# EAGLE schematic Gadget-Box (EAGLE 6.6.0)

## Sheet 1 of 3
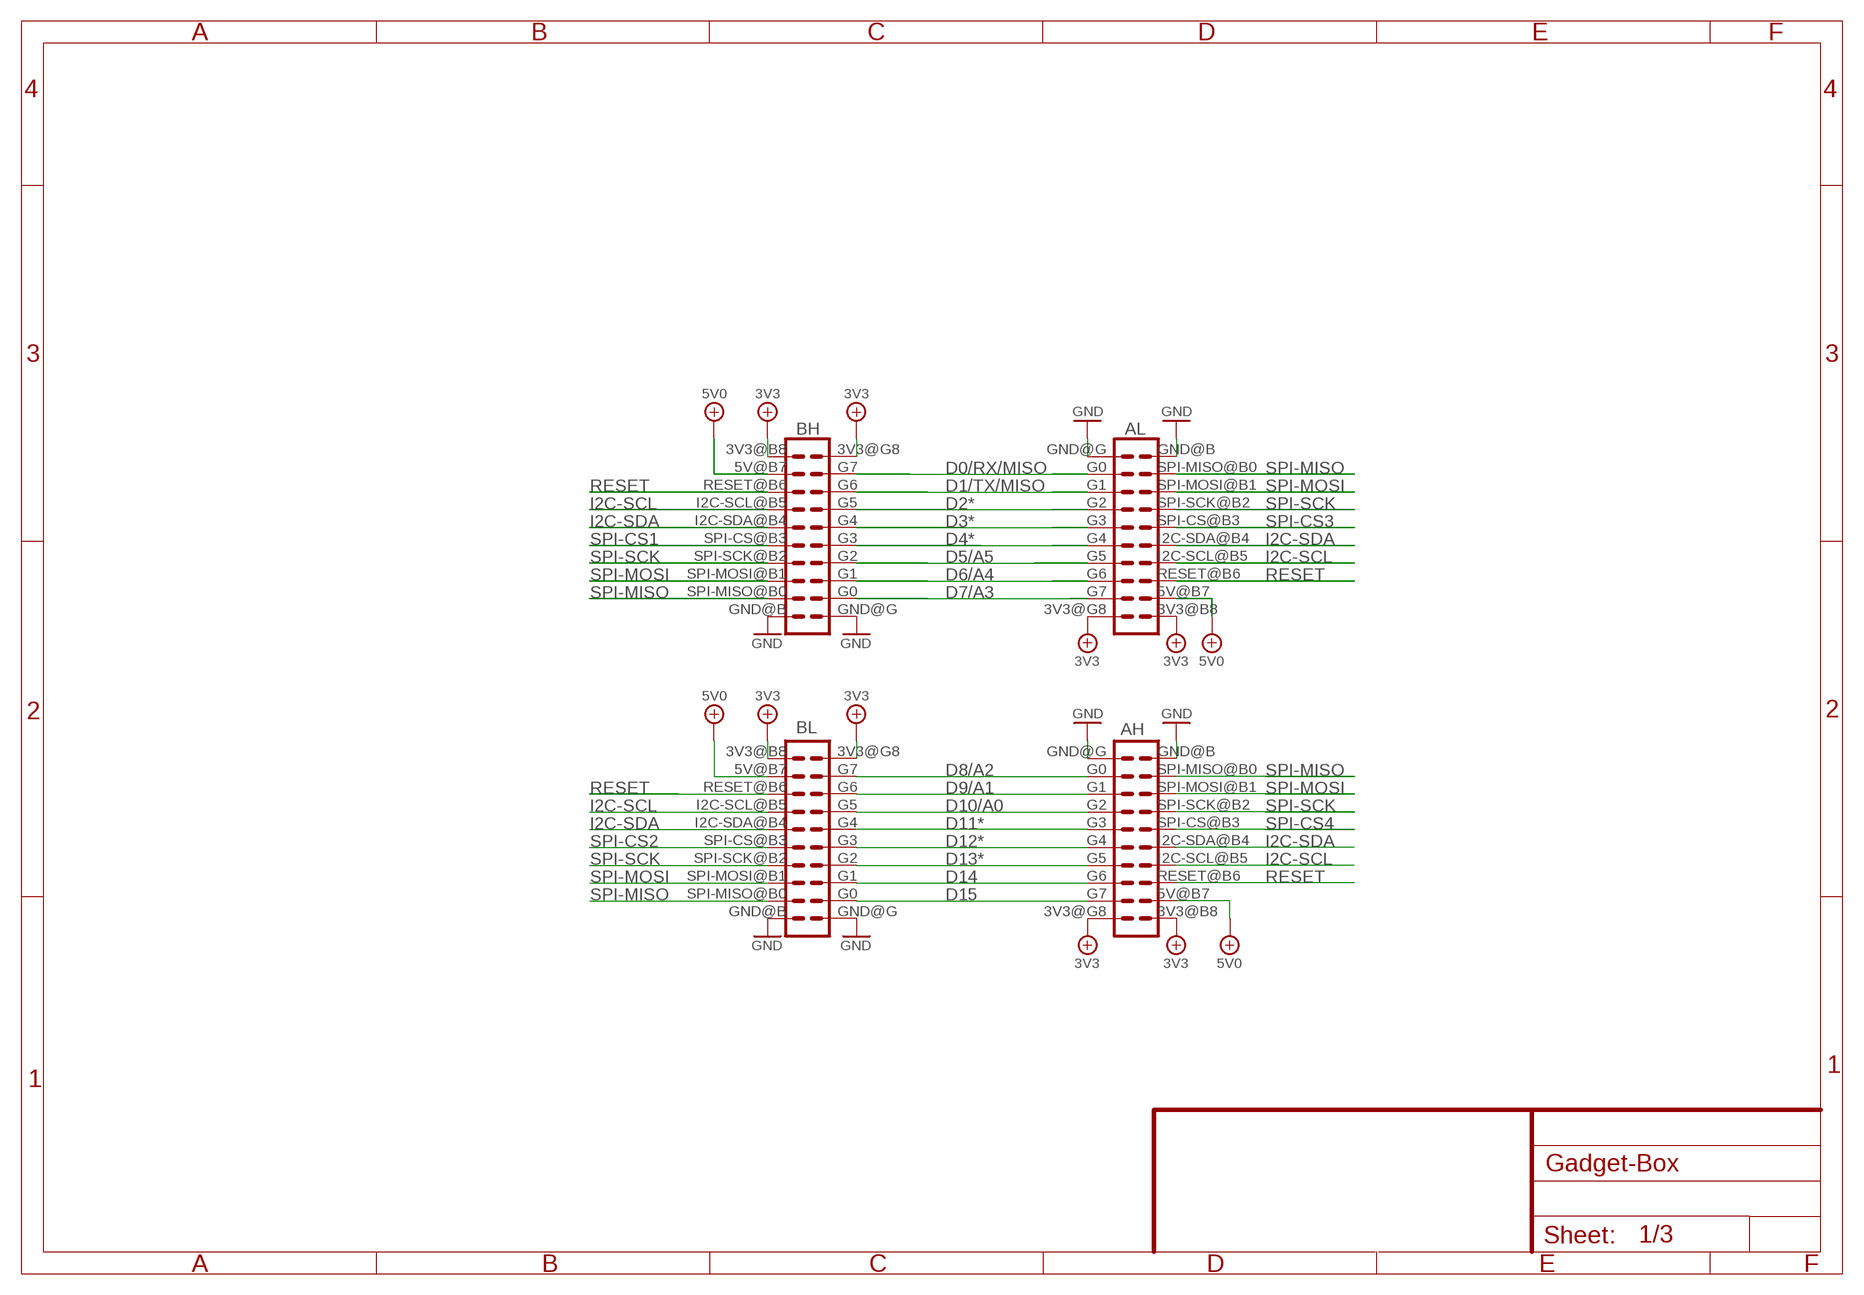
[diagram p0: schematic, sheet 1]

### Parts
AH  ECOGECOG_SLOT  [ECOG]
AL  ECOGECOG_SLOT  [ECOG]
BH  ECOGECOG_SLOT  [ECOG]
BL  ECOGECOG_SLOT  [ECOG]

### Nets
3V3: AH.3V3@B8(3V3) AH.3V3@G8(3V3) AL.3V3@B8(3V3) AL.3V3@G8(3V3) BH.3V3@B8(3V3) BH.3V3@G8(3V3) BL.3V3@B8(3V3) BL.3V3@G8(3V3) ; also sheet 2,3
D0/RX/MISO: AL.G0 BH.G7 ; also sheet 2
D1/TX/MISO: AL.G1 BH.G6 ; also sheet 2
D2*: AL.G2 BH.G5 ; also sheet 2
D3*: AL.G3 BH.G4 ; also sheet 2
D4*: AL.G4 BH.G3 ; also sheet 2
D5/A5: AL.G5 BH.G2 ; also sheet 2,3
D6/A4: AL.G6 BH.G1 ; also sheet 2
D7/A3: AL.G7 BH.G0 ; also sheet 2
D8/A2: AH.G0 BL.G7 ; also sheet 2
D9/A1: AH.G1 BL.G6 ; also sheet 2
D10/A0: AH.G2 BL.G5 ; also sheet 2
D11*: AH.G3 BL.G4 ; also sheet 2
D12*: AH.G4 BL.G3 ; also sheet 2
D13*: AH.G5 BL.G2 ; also sheet 2
D14: AH.G6 BL.G1 ; also sheet 2
D15: AH.G7 BL.G0 ; also sheet 2
GND [gnd]: AH.GND@B(GND) AH.GND@G(GND) AL.GND@B(GND) AL.GND@G(GND) BH.GND@B(GND) BH.GND@G(GND) BL.GND@B(GND) BL.GND@G(GND) ; also sheet 2,3
I2C-SCL: AH.I2C-SCL@B5(I2C-SCL) AL.I2C-SCL@B5(I2C-SCL) BH.I2C-SCL@B5(I2C-SCL) BL.I2C-SCL@B5(I2C-SCL) ; also sheet 2
I2C-SDA: AH.I2C-SDA@B4(I2C-SDA) AL.I2C-SDA@B4(I2C-SDA) BH.I2C-SDA@B4(I2C-SDA) BL.I2C-SDA@B4(I2C-SDA) ; also sheet 2
RESET: AH.RESET@B6(RESET) AL.RESET@B6(RESET) BH.RESET@B6(RESET) BL.RESET@B6(RESET) ; also sheet 2
SPI-CS1: BH.SPI-CS@B3(SPI-CS) ; also sheet 2
SPI-CS2: BL.SPI-CS@B3(SPI-CS) ; also sheet 2
SPI-CS3: AL.SPI-CS@B3(SPI-CS) ; also sheet 2
SPI-CS4: AH.SPI-CS@B3(SPI-CS) ; also sheet 2
SPI-MISO: AH.SPI-MISO@B0(SPI-MISO) AL.SPI-MISO@B0(SPI-MISO) BH.SPI-MISO@B0(SPI-MISO) BL.SPI-MISO@B0(SPI-MISO) ; also sheet 2
SPI-MOSI: AH.SPI-MOSI@B1(SPI-MOSI) AL.SPI-MOSI@B1(SPI-MOSI) BH.SPI-MOSI@B1(SPI-MOSI) BL.SPI-MOSI@B1(SPI-MOSI) ; also sheet 2
SPI-SCK: AH.SPI-SCK@B2(SPI-SCK) AL.SPI-SCK@B2(SPI-SCK) BH.SPI-SCK@B2(SPI-SCK) BL.SPI-SCK@B2(SPI-SCK) ; also sheet 2
VBUS: AH.5V@B7(5V) AL.5V@B7(5V) BH.5V@B7(5V) BL.5V@B7(5V) ; supply symbol labelled 5V0 ; also sheet 2,3

## Sheet 2 of 3
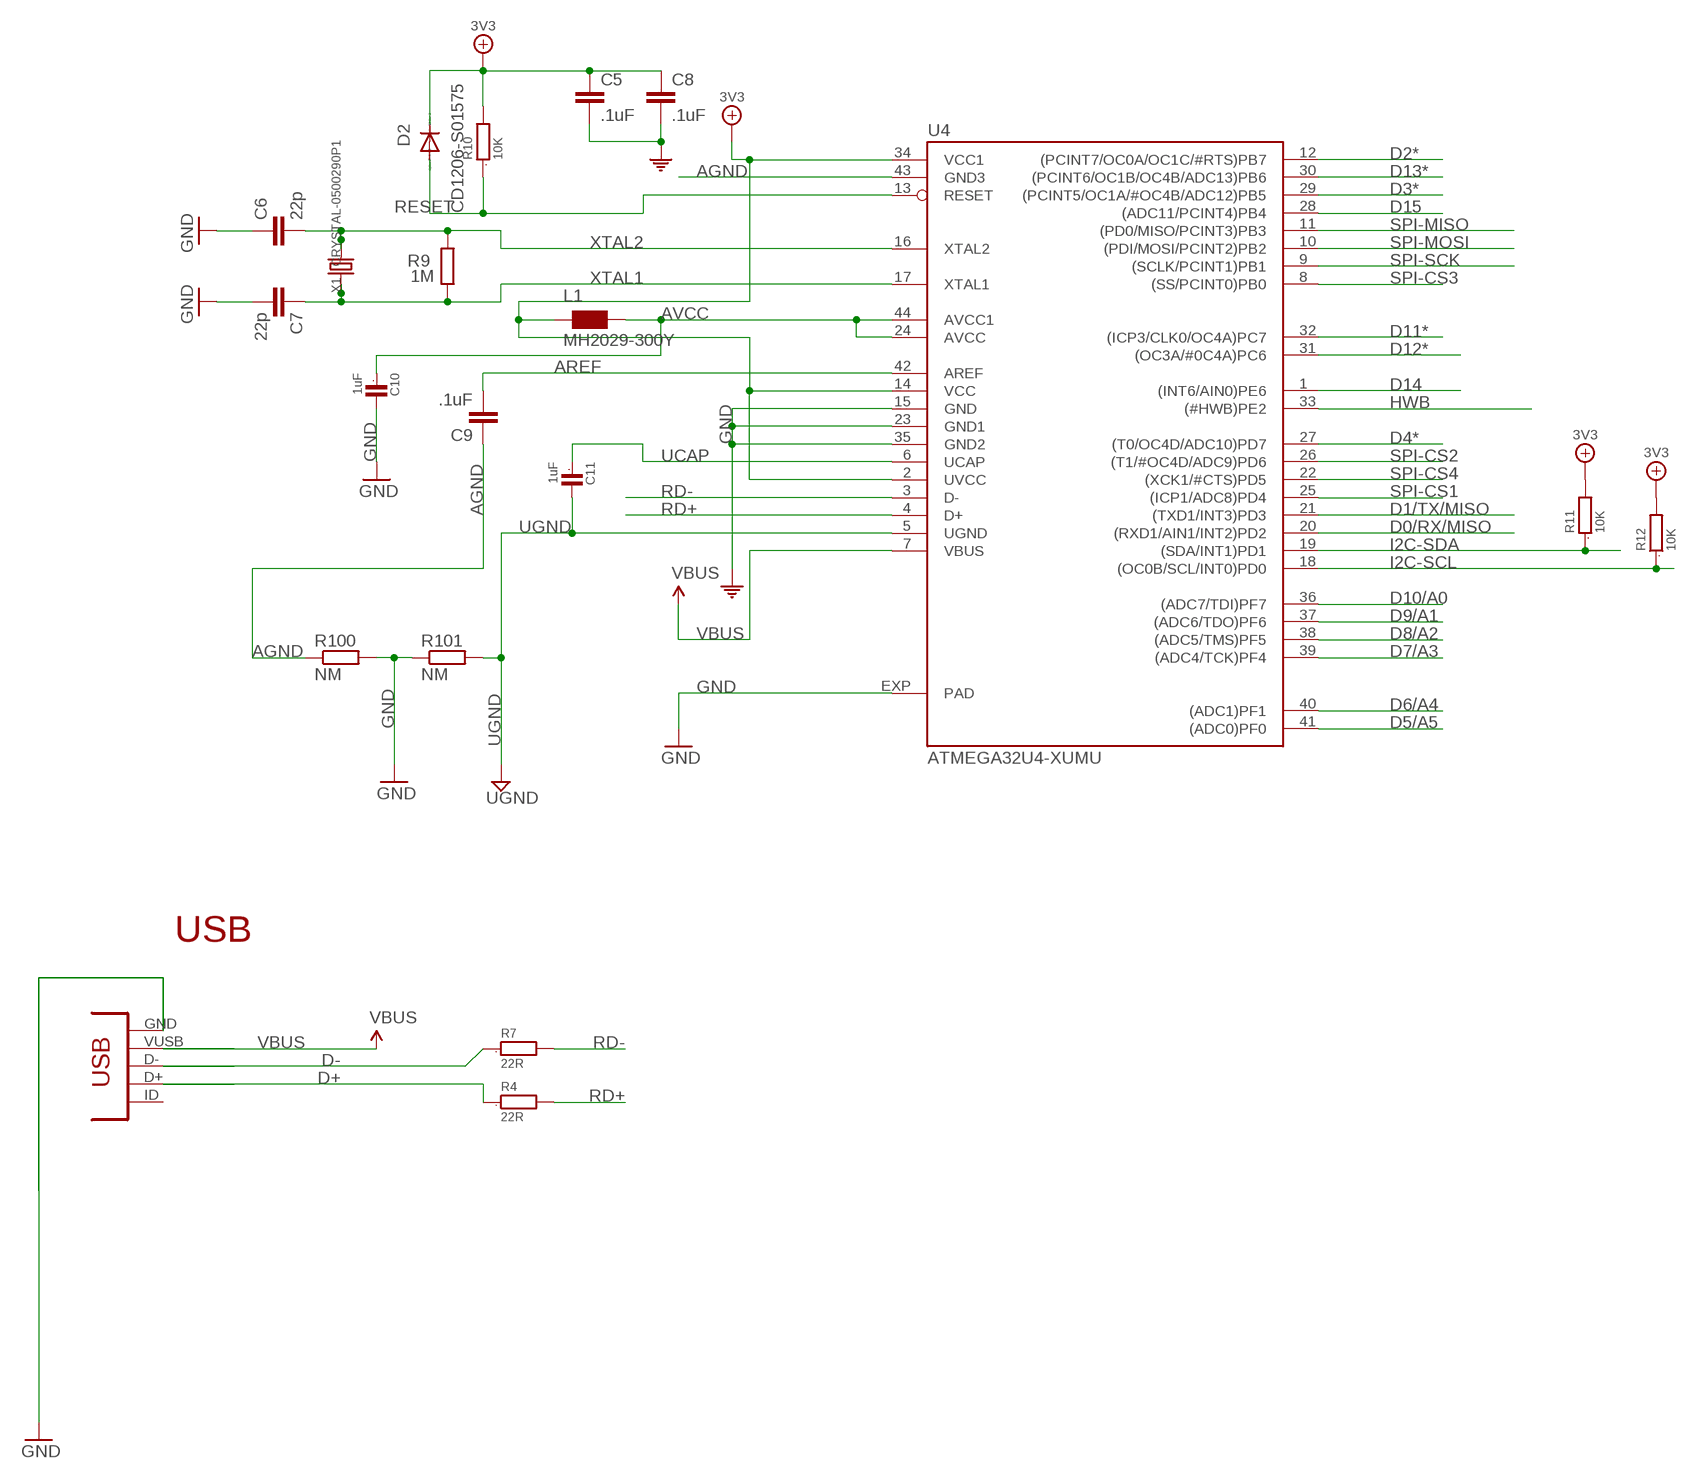
[diagram p1: schematic, sheet 2, part 1 of 2]
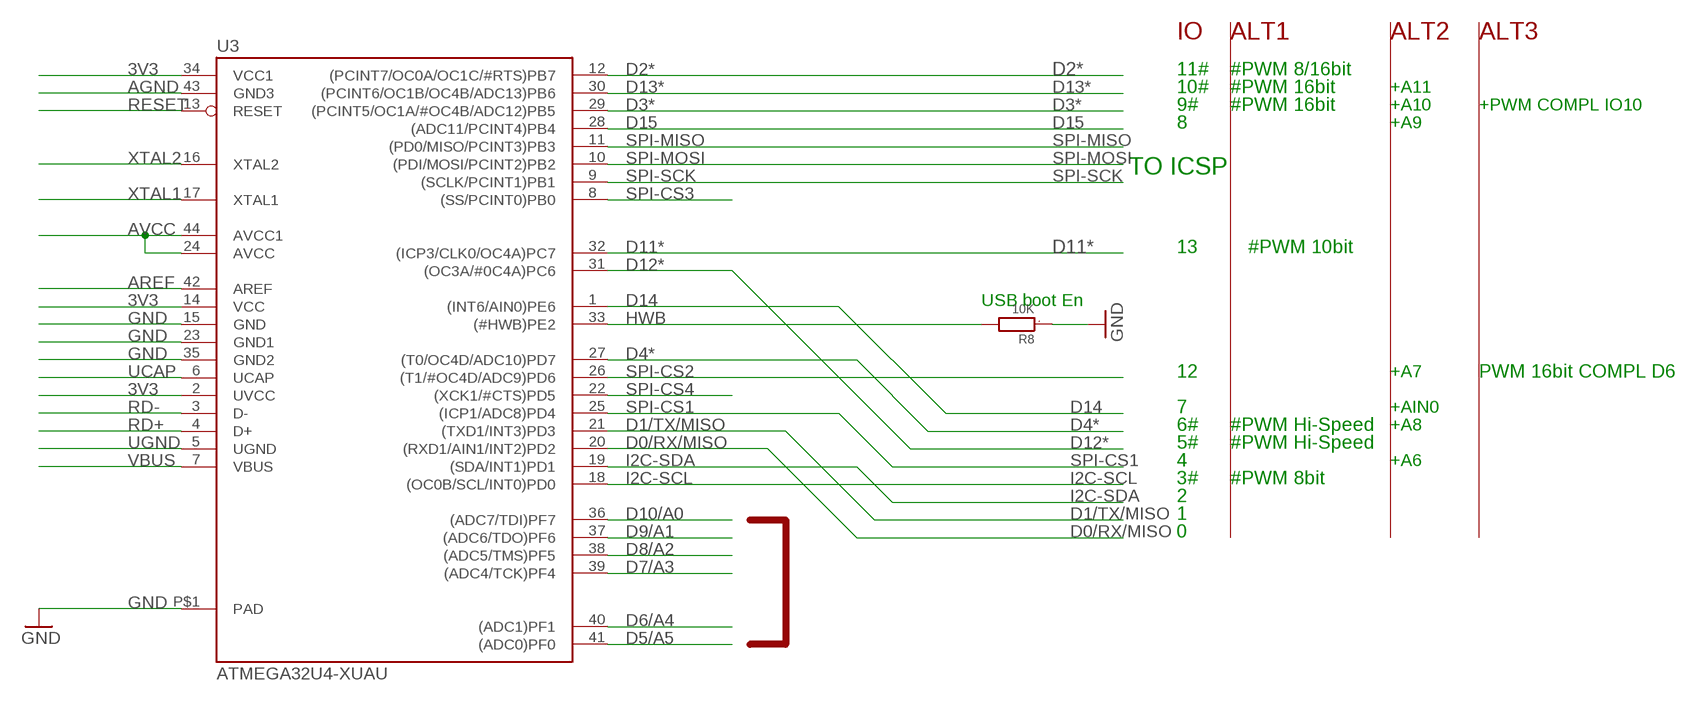
[diagram p2: schematic, sheet 2, part 2 of 2]

### Parts
C5  .1uF  C-EUC0603  [C0603-ROUND]
C6  22p  C-EUC0603  [C0603-ROUND]
C7  22p  C-EUC0603  [C0603-ROUND]
C8  .1uF  C-EUC0603  [C0603-ROUND]
C9  .1uF  C-EUC0603  [C0603-ROUND]
C10  1uF  C0603  [0603]
C11  1uF  C0603  [0603]
D2  CD1206-S01575  DIODE-MINIMELF  [MINIMELF]
L1  MH2029-300Y  WE-CBF_0805  [0805]
R4  22R  R0805  [0805]
R7  22R  R0805  [0805]
R8  10K  R0603  [0603]
R9  1M  R-EU_R0603  [R0603-ROUND]
R10  10K  R0603  [0603]
R11  10K  R0603  [0603]
R12  10K  R0603  [0603]
R100  NM  R-EU_R0402  [R0402]
R101  NM  R-EU_R0402  [R0402]
U3  ATMEGA32U4-XUAU  [TQFP44-PAD]
U4  ATMEGA32U4-XUMU  [QFN44ML7X7]
USB  CONN_USB  [CONN_USB_MINI-B]
X1  CRYSTAL-0500290P1  [2P-SMD-5.0X3.2]

### Nets
3V3: C5.1 C8.1 D2.C L1.1 R10.2 R11.2 R12.2 U3.2(UVCC) U3.14(VCC) U3.34(VCC1) U4.2(UVCC) U4.14(VCC) U4.34(VCC1) ; also sheet 1,3
AGND: C9.1 R100.1 U3.43(GND3) U4.43(GND3)
AREF [aref]: C9.2 U3.42(AREF) U4.42(AREF)
AVCC: C10.1 L1.2 U3.24(AVCC) U3.44(AVCC1) U4.24(AVCC) U4.44(AVCC1)
D0/RX/MISO: U3.20((RXD1/AIN1/INT2)PD2) U4.20((RXD1/AIN1/INT2)PD2) ; also sheet 1
D1/TX/MISO: U3.21((TXD1/INT3)PD3) U4.21((TXD1/INT3)PD3) ; also sheet 1
D2*: U3.12((PCINT7/OC0A/OC1C/#RTS)PB7) U4.12((PCINT7/OC0A/OC1C/#RTS)PB7) ; also sheet 1
D3*: U3.29((PCINT5/OC1A/#OC4B/ADC12)PB5) U4.29((PCINT5/OC1A/#OC4B/ADC12)PB5) ; also sheet 1
D4*: U3.27((T0/OC4D/ADC10)PD7) U4.27((T0/OC4D/ADC10)PD7) ; also sheet 1
D5/A5: U3.41((ADC0)PF0) U4.41((ADC0)PF0) ; also sheet 1,3
D6/A4: U3.40((ADC1)PF1) U4.40((ADC1)PF1) ; also sheet 1
D7/A3: U3.39((ADC4/TCK)PF4) U4.39((ADC4/TCK)PF4) ; also sheet 1
D8/A2: U3.38((ADC5/TMS)PF5) U4.38((ADC5/TMS)PF5) ; also sheet 1
D9/A1: U3.37((ADC6/TDO)PF6) U4.37((ADC6/TDO)PF6) ; also sheet 1
D10/A0: U3.36((ADC7/TDI)PF7) U4.36((ADC7/TDI)PF7) ; also sheet 1
D11*: U3.32((ICP3/CLK0/OC4A)PC7) U4.32((ICP3/CLK0/OC4A)PC7) ; also sheet 1
D12*: U3.31((OC3A/#0C4A)PC6) U4.31((OC3A/#0C4A)PC6) ; also sheet 1
D13*: U3.30((PCINT6/OC1B/OC4B/ADC13)PB6) U4.30((PCINT6/OC1B/OC4B/ADC13)PB6) ; also sheet 1
D14: U3.1((INT6/AIN0)PE6) U4.1((INT6/AIN0)PE6) ; also sheet 1
D15: U3.28((ADC11/PCINT4)PB4) U4.28((ADC11/PCINT4)PB4) ; also sheet 1
D+: R4.1 USB.D+
D-: R7.1 USB.D-
GND [gnd]: C5.2 C6.1 C7.2 C8.2 C10.2 R8.1 R100.2 R101.1 U3.15(GND) U3.23(GND1) U3.35(GND2) U3.P$1(PAD) U4.15(GND) U4.23(GND1) U4.35(GND2) U4.EXP(PAD) USB.GND ; supply symbol labelled COM ; also sheet 1,3
HWB: R8.2 U3.33((#HWB)PE2) U4.33((#HWB)PE2)
I2C-SCL: R12.1 U3.18((OC0B/SCL/INT0)PD0) U4.18((OC0B/SCL/INT0)PD0) ; also sheet 1
I2C-SDA: R11.1 U3.19((SDA/INT1)PD1) U4.19((SDA/INT1)PD1) ; also sheet 1
RD+: R4.2 U3.4(D+) U4.4(D+)
RD-: R7.2 U3.3(D-) U4.3(D-)
RESET: D2.A R10.1 U3.13(RESET) U4.13(RESET) ; also sheet 1
SPI-CS1: U3.25((ICP1/ADC8)PD4) U4.25((ICP1/ADC8)PD4) ; also sheet 1
SPI-CS2: U3.26((T1/#OC4D/ADC9)PD6) U4.26((T1/#OC4D/ADC9)PD6) ; also sheet 1
SPI-CS3: U3.8((SS/PCINT0)PB0) U4.8((SS/PCINT0)PB0) ; also sheet 1
SPI-CS4: U3.22((XCK1/#CTS)PD5) U4.22((XCK1/#CTS)PD5) ; also sheet 1
SPI-MISO: U3.11((PD0/MISO/PCINT3)PB3) U4.11((PD0/MISO/PCINT3)PB3) ; also sheet 1
SPI-MOSI: U3.10((PDI/MOSI/PCINT2)PB2) U4.10((PDI/MOSI/PCINT2)PB2) ; also sheet 1
SPI-SCK: U3.9((SCLK/PCINT1)PB1) U4.9((SCLK/PCINT1)PB1) ; also sheet 1
UCAP: C11.1 U3.6(UCAP) U4.6(UCAP)
UGND [gnd]: C11.2 R101.2 U3.5(UGND) U4.5(UGND)
VBUS: U3.7(VBUS) U4.7(VBUS) USB.VUSB ; also sheet 1,3
XTAL1: C7.1 R9.1 U3.17(XTAL1) U4.17(XTAL1) X1.1
XTAL2: C6.2 R9.2 U3.16(XTAL2) U4.16(XTAL2) X1.2
Unconnected: USB.BODY@1(BODY) USB.BODY@2(BODY) USB.BODY@3(BODY) USB.BODY@4(BODY) USB.ID(USBID)

### Notes on the sheet
- IO | ALT1 | ALT2 | ALT3
- 11# | #PWM 8/16bit
- 10# | #PWM 16bit | +A11
- 9# | #PWM 16bit | +A10 | +PWM COMPL IO10
- 8 | +A9
- TO ICSP
- 13 | #PWM 10bit
- USB boot En
- 12 | +A7 | PWM 16bit COMPL D6
- 7 | +AIN0
- 6# | #PWM Hi-Speed | +A8
- 5# | #PWM Hi-Speed
- 4 | +A6
- 3# | #PWM 8bit
- 2
- 1
- 0
- USB

## Sheet 3 of 3
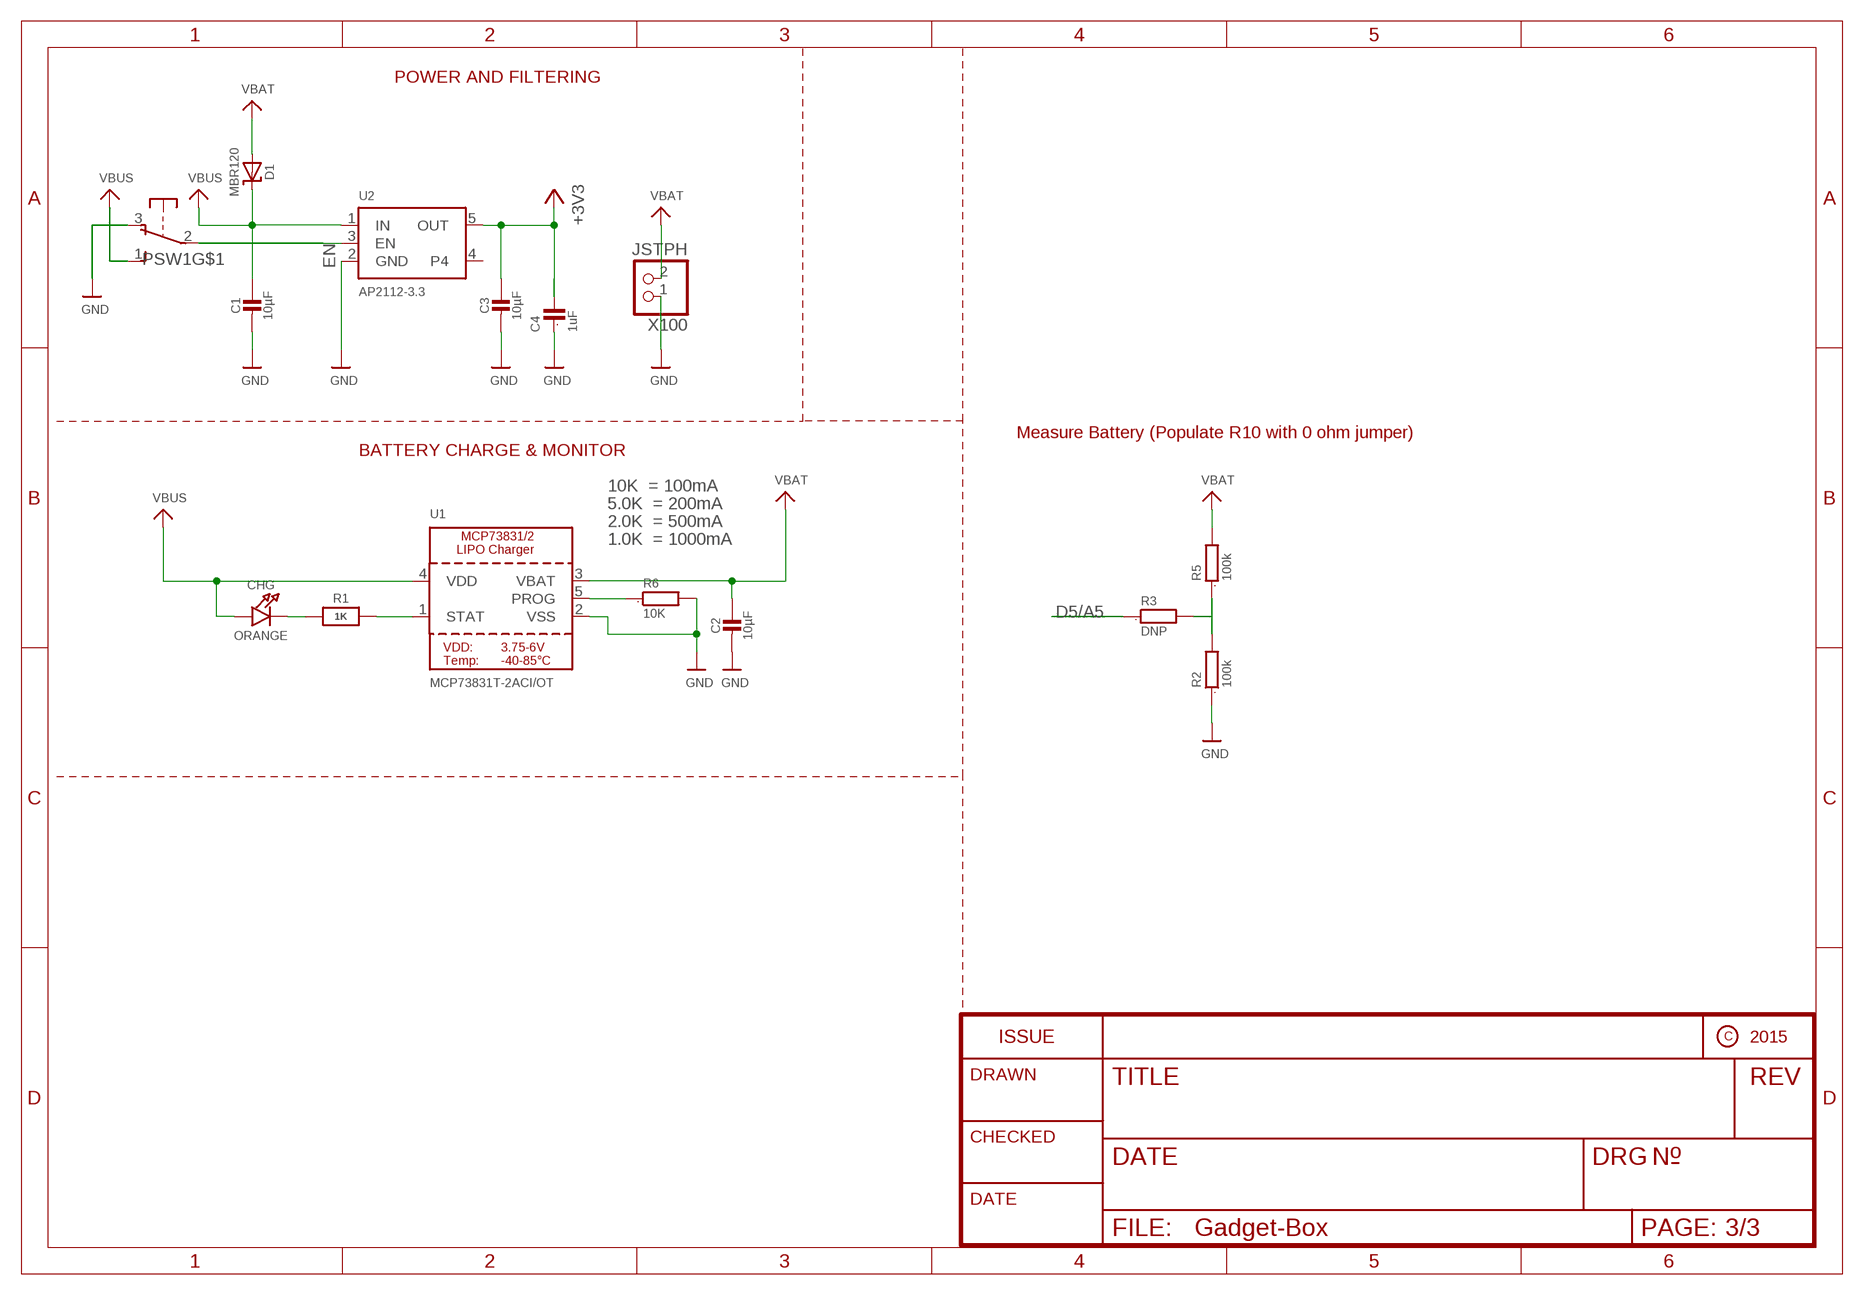
[diagram p3: schematic, sheet 3]

### Parts
C1  10µF  CAP_CERAMIC0805-NOOUTLINE  [0805-NO]
C2  10µF  CAP_CERAMIC0805-NOOUTLINE  [0805-NO]
C3  10µF  CAP_CERAMIC0805-NOOUTLINE  [0805-NO]
C4  1uF  C0603  [0603]
CHG  ORANGE  LED0805_NOOUTLINE  [CHIPLED_0805_NOOUTLINE]
D1  MBR120  DIODE-SCHOTTKYSOD-123  [SOD-123]
PSW1  OS102011MA1Q  [OS102011MA1Q]
R1  1K  RESISTOR_0603_NOOUT  [0603-NO]
R2  100k  R0603  [0603]
R3  DNP  R0603  [0603]
R5  100k  R0603  [0603]
R6  10K  R0603  [0603]
U1  MCP73831T-2ACI/OT  MCP73831/2  [SOT23-5]
U2  AP2112-3.3  VREG_SOT23-5  [SOT23-5]
X100  JSTPH  CON_JST_PH_2PIN  [JSTPH2]

### Nets
3V3: C3.1 C4.2 U2.5(OUT) ; supply symbol labelled +3V3 ; also sheet 1,2
D5/A5: R3.1 ; also sheet 1,2
EN: PSW1.2(P) U2.3(EN)
GND [gnd]: C1.2 C2.2 C3.2 C4.1 PSW1.3(O) R2.1 R6.2 U1.2(VSS) U2.2(GND) X100.1 ; also sheet 1,2
N$1: CHG.C R1.1
N$2: R2.2 R3.2 R5.1
N$3: R1.2 U1.1(STAT)
N$4: R6.1 U1.5(PROG)
VBAT: C2.1 D1.A R5.2 U1.3(VBAT) X100.2
VBUS: C1.1 CHG.A D1.C PSW1.1(S) U1.4(VDD) U2.1(IN) ; also sheet 1,2
Unconnected: PSW1.MT1(MT) PSW1.MT2(MT) U2.4

### Notes on the sheet
- POWER AND FILTERING
- Measure Battery (Populate R10 with 0 ohm jumper)
- BATTERY CHARGE & MONITOR
- 10K  = 100mA
- 5.0K  = 200mA
- 2.0K  = 500mA
- 1.0K  = 1000mA

## Library data of the parts
AH AL BH BL = eCogs:ECOG; PARTNO: PPPC102LFBN-RC,SULLINS CONNECTOR SOLUTIONS,dk,S6106-ND,"CONN HEADER FEM 20POS.1"" DL GOLD", REF67
C1-C3 = microbuilder:CAP_CERAMIC: Ceramic Capacitors For new designs, use the packages preceded by an '_' character since they are more reliable: The following footprints should be used on most boards: _0402 - Standard footprint for regular board layouts _0603 - Standard footprint for regular board layouts _0805 - Standard footprint for regular board layouts _1206 - Standard footprint for regular board layouts For extremely tight-pitch boards where space is at a premium, the following 'micro-pitch' footprints can be used (smaller pads, no silkscreen outline, etc.): _0402MP - Micro-pitch footprint for very dense/compact boards _0603MP - Micro-pitch footprint for very dense/compact boards _0805MP - Micro-pitch footprint for very dense/compact boards _1206MP - Micro-pitch footprint for very dense/compact boards; PARTNO: CL21F106ZPFNNNE,Samsung,DK,1276-3012-1-ND,CAP CER 10UF 10V Y5V 0805, REF1
C4 C10 C11 = GadgetFactory:C: CAPACITOR, European symbol; PARTNO: C1608X5R1A105K080AC,TDK CORPORATION (VA),dk,445-1321-1-ND,CAP CER 1UF 10V X5R 0603, REF53
C5 C8 C9 = SmartPrj:C-EU: CAPACITOR, European symbol; PARTNO: GRM188F51E104ZA01D,MURATA ELECTRONICS (VA),DK,490-1575-1-ND,CAP CER .1UF 25V Y5V 0603, REF2
C6 C7 = SmartPrj:C-EU: CAPACITOR, European symbol; PARTNO: C1608C0G1H220J080AA,TDK CORPORATION (VA),dk,445-1273-1-ND,CAP CER 22PF 50V C0G 0603, REF58
CHG = microbuilder:LED: LED 0603 - 0603 Surface Mount Package 2mA: Green LED - Low Power (3.9mcd, 2ma, 1.7Vf) - Digikey: 475-2709-2-ND Orange LED - Low Power (9.8mcd, 2ma, 1.8Vf) - Digikey: 475-1194-2-ND Red LED - Low Power (5mcd, 2ma, 1.8Vf) - Digikey: 475-1195-2-ND Yellow LED - Low Power (7mcd, 2ma, 1.8Vf) - Digikey: 475-1196-2-ND 5mA: Blue LED - Low Power (17mcd, 5ma, 2.9Vf) - Digikey: LNJ937W8CRACT-ND 0805 - 0805 Surface Mount Package 2mA: Red LED (8.8mcd, 2mA, 1.8Vf, Clear) - Low Power [Digikey: 475-2510-1-ND] Green LED (5mcd, 2mA, 1.8Vf, Clear) - Low Power [Digikey: 475-2730-1-ND] Yellow LED (11.3mcd, 2mA, 1.8Vf, Clear) - Low Power [Digikey: 475-2555-1-ND] 20mA: Red LED (104mcd, 20mA, Diffused) - LS R976 [Digikey: 475-1278-6-ND] Red LED (12mcd, 20mA, 2.0Vf, Clear) - APT2012EC [Digikey: 754-1128-1-ND] Green LED (15mcd, 20mA, 2.2Vf, Clear) - APT2012GC [Digikey: 754-1131-1-ND] Orange LED (160mcd, 20mA, 2.1Vf, Clear) - APT2012SECK [Digikey: 754-1130-1-ND] 1206 - 1206 Surface Mount Package Green LED (26mcd, 20mA, Diffused) - LG N971 [Digikey: 475-1407-6-ND] Red LED (15mcd, 20mA, Diffused) - LH N974 [Digikey: 475-1416-6-ND] Cree - Cree High-Power Surface Mount LEDs XPEBWT-L1-0000-00D50 - White 111lm 350mA 2.9Vf 6200K 110° XTEAWT-00-0000-00000LEE3 - White 114lm 350mA 2.85Vf 5000K 115° Everlight - Everlight 45-21 Series Surface Mount LEDs 45-21/QK2C-B2832AC2CB2/2T - Warm White 2000mcd 20mA 3.25Vf 3050K 120° 45-21/LK2C-B38452C4CB2/2T - Nuetral White 2000mcd 20mA 3.25Vf 4150K 120° 45-21/LK2C-B50634C6CB2/2T - Cold White 2200mcd 20mA 3.25Vf 5650K 120° PLCC2 Reverse Mount LS T77K-J1L2-1-0-2-R18-Z - Red 11.25mcd 2mA 1.8Vf 630nm 120° LO T77K-L1M2-24-Z - Orange 19.6mcd 2mA 1.8Vf 606nm 120° LY T77K-K2M1-26-Z - Yellow 15.7mcd 2mA 1.8Vf 587nm 120°; PARTNO: LTST-C171EKT,LITE-ON INC (VA),DK,160-1422-1-ND,LED RED ORAN CLEAR THIN 0805 SMD, REF6
D1 = microbuilder:DIODE-SCHOTTKY; PARTNO: MBR120VLSFT3G,on semiconductor,dk,MBR120VLSFT3GOSCT-ND ,DIODE SCHOTTKY 20V 1A SOD123FL , REF71
D2 = diode:DIODE-: DIODE; PARTNO: CD1206-S01575,BOURNS INC (VA),dk,CD1206-S01575CT-ND,DIODE GEN PURP 100V 150MA 1206, REF46
L1 = wuerth-elektronik:WE-CBF: SMD EMI Suppression Ferrite Beads - excellent anti-EMI properties - low DCR - impedances till 3000 ohms - rated current up to 6 A; PARTNO: MH2029-300Y,BOURNS INC (VA),dk,MH2029-300YCT-ND,FERRITE BEAD 30 OHM 0805 1LN, REF60
PSW1 = adafruit:OS102011MA1Q: OS10201MA1Q through-hole right angle switch http://www.ladyada.net/library/eagle; PARTNO: OS102011MA1QN1,C&K Components,dk,CKN9559-ND,SWITCH SLIDE SPDT 100MA 12V , REF72
R1 = microbuilder:RESISTOR: Resistors For new designs, use the packages preceded by an '_' character since they are more reliable: The following footprints should be used on most boards: _0402 - Standard footprint for regular board layouts _0603 - Standard footprint for regular board layouts _0805 - Standard footprint for regular board layouts _1206 - Standard footprint for regular board layouts For extremely tight-pitch boards where space is at a premium, the following 'micro-pitch' footprints can be used (smaller pads, no silkscreen outline, etc.): _0402MP - Micro-pitch footprint for very dense/compact boards _0603MP - Micro-pitch footprint for very dense/compact boards _0805MP - Micro-pitch footprint for very dense/compact boards _1206MP - Micro-pitch footprint for very dense/compact boards; PARTNO: RC0603JR-071KL,YAGEO (VA),dk,311-1.0KGRTR-ND,RES SMD 1K OHM 5% 1/10W 0603 , REF73
R2 R5 = GadgetFactory:R: RESISTOR, European symbol; PARTNO: RC0603JR-07100KL,YAGEO (VA),dk,311-100KGRCT-ND,RES SMD 100K OHM 5% 1/10W 0603 , REF76
R3 = GadgetFactory:R: RESISTOR, European symbol; BOM: EXCLUDE
R4 R7 = GadgetFactory_6.0:R: RESISTOR, European symbol; PARTNO: RMCF0805JT22R0,STACKPOLE ELECTRONICS INC (VA),dk,RMCF0805JT22R0CT-ND,RES SMD 22 OHM 5% 1/8W 0805, REF62
R6 R11 R12 = GadgetFactory:R: RESISTOR, European symbol; PARTNO: RC0603JR-0710KL,YAGEO (VA),dk,311-10KGRCT-ND,RES SMD 10K OHM 5% 1/10W 0603 , REF36
R8 R10 = GadgetFactory_6.0:R: RESISTOR, European symbol; PARTNO: RC0603JR-0710KL,YAGEO (VA),dk,311-10KGRCT-ND,RES SMD 10K OHM 5% 1/10W 0603 , REF36
R9 = SmartPrj:R-EU_: RESISTOR, European symbol; PARTNO: RMCF0603JT1M00,STACKPOLE ELECTRONICS INC (VA),dk,RMCF0603JT1M00CT-ND,RES SMD 1M OHM 5% 1/10W 0603, REF57
R100 R101 = SmartPrj:R-EU_: RESISTOR, European symbol; BOM: EXCLUDE
U1 = microbuilder:MCP73831/2: MCP73831/2 LIPO Charger VDD: 3.75 - 6V Temp -40 - 85°C Programmable Charge Rate: 15-500mA NOTE: STAT is a tri-state logic output on the MCP73831 and an open-drain output on the MCP73832. SOT23-5 with 4.2V output and tri-state logic on STAT = MCP73831T-2ACI/OT; PARTNO: MCP73831T-2ACI/OT,MICROCHIP TECHNOLOGY (VA),dk,MCP73831T-2ACI/OTCT-ND,IC CONTROLLR LI-ION 4.2V SOT23-5, REF74
U2 = microbuilder:VREG_SOT23-5: SOT23-5 Fixed Voltage Regulators Part Current Out V Out V In V Dropout θJA (°C/W) TJ (°C) Digikey Part No. ADP121 150mA 3.3V 3.4-5.5V 0.09V @ 150mA -- -- ADP121-AUJZ33R7CT-ND ADP121 150mA 3.0V 3.1-5.5V 0.09V @ 150mA -- -- ADP121-AUJZ30R7CT-ND ADP122 300mA 3.3V 3.4-5.5V 0.085V @ 300mA -- -- ADP122AUJZ-3.3-R7CT-ND ADP1712 300mA 3.3V 3.5-5.5V 0.17V @ 300mA -- -- ADP1712AUJZ-3.3-R7TR-ND AP7311 (Low Cost) 150mA 3.3V 3.5-6V 0.15V @ 150mA -- -- AP7311-33WG-7DICT-ND LD39015M18R 150mA 1.8V 1.9V-5.5V 0.08V @ 100mA -- -- 497-6977-1-ND LP2985A-33DBVR 150mA 3.3V 3.3-16V 0.28V @ 150mA 206 150 296-18479-1-ND MCP1824T-3302E/OT 300mA 3.3V 3.5V-6V 0.2V @ 300mA -- -- MCP1824T-3302E/OTCT-ND MIC5205-2.5YM5 TR 150mA 2.5V 2.7-16V 0.165V @ 150mA -- -- 576-1257-2-ND MIC5205-3.0YM5 TR 150mA 3.0V 3.2V-16V 0.165V @ 150mA -- -- 576-1258-2-ND MIC5205-3.3YM5 TR 150mA 3.3V 3.5V-16V 0.165V @ 150mA -- -- 576-1259-2-ND TPS780330220 150mA 3.3V+2.2V 3.6-5.5V 250mV Max -- -- 296-23332-1-ND TDA3663/N1,135 100mA 3.3V 3.5-45V 0.18V @ 50mA -- -- 568-5343-1-ND Max operating temp can be calculated using θJA, TJ (max junction temperature), and power in watts. Set the "Maximum Ambient Temperature" until it reaches TJ ("Max Junction Temperature"), which is the absolute limit for safe use of the regulator: Heat Sink Temperature Calculator <http://www.daycounter.com/Calculators/Heat-Sink-Temperature-Calculator.phtml> For example, With 12V source into a 3.3V LP2985 and a 30mA load, we are dissipating (12V-3.3V) * 0.03A = 0.261W. With a θJA of 206 °C/W, a TJ of 150°C, and 261mW we can safely use the chip without a heat sink up to 75°C (=147.1°C Junction Temperature).; PARTNO: AP2112K-3.3TRG1,Diodes Incorporated,dk,AP2112K-3.3TRG1DICT-ND,IC REG LDO 3.3V 0.6A SOT25 , REF75
U3 = SmartPrj:ATMEGA32U4-XU; PARTNO: ATMEGA32U4-AUR,ATMEL (VA),dk,ATMEGA32U4-AURCT-ND,IC MCU 8BIT 32KB FLASH 44TQFP, REF48
U4 = SmartPrj:ATMEGA32U4-XU; BOM: EXCLUDE
USB = dp_devices:CONN_USB: USB connector; PARTNO: USB-M26FTR,ON SHORE TECHNOLOGY INC (VA),dk,ED2992CT-ND,CONN USB MINI B R/A SMD, REF66
X1 = OPL Eagle Library:CRYSTAL*; PARTNO: ABM3-8.000MHZ-D2Y-T,Abracon Corporation,dk,535-10630-1-ND ,CRYSTAL 8.0000MHZ 18PF SMD , REF70
X100 = microbuilder:CON_JST_PH_2PIN: JST 2-Pin Right-Angle Connector PH-Series - 4UConnector: 17311 SH-Series - 4UConnector: 07278; PARTNO: S2B-PH-SM4-TB(LF)(SN),JST SALES AMERICA INC (VA),dk,455-1749-1-ND,CONN HEADER PH SIDE 2POS 2MM SMD, REF69

## Net classes
2 gnd: width 0.254 mm, drill 0.381 mm, clearance 0.254 mm
3 usbvcc: width 0.254 mm, drill 0.381 mm, clearance 0.254 mm
4 aref: width 0.254 mm, drill 0.381 mm, clearance 0.254 mm